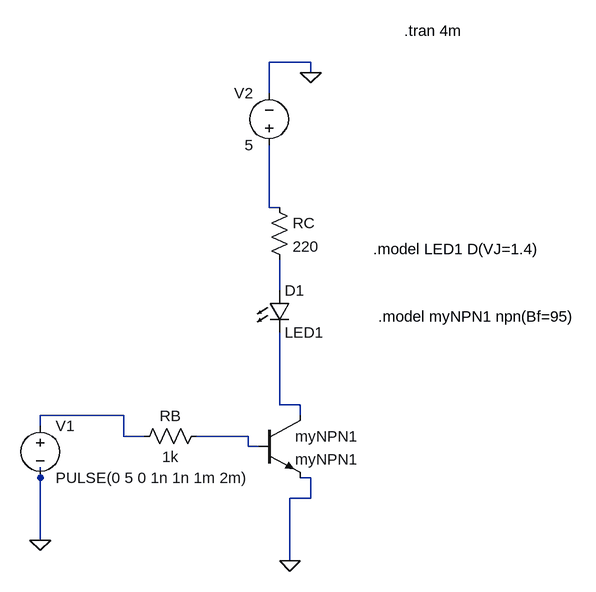
[diagram p0: schematic Draft5.asc]
Draft5.asc, the LTspice schematic file:
Version 4
SHEET 1 1180 680
WIRE 512 -416 448 -416
WIRE 512 -400 512 -416
WIRE 448 -368 448 -416
WIRE 448 -192 448 -288
WIRE 464 -192 448 -192
WIRE 464 -64 464 -112
WIRE 464 112 464 0
WIRE 496 112 464 112
WIRE 224 128 96 128
WIRE 496 128 496 112
WIRE 96 144 96 128
WIRE 224 160 224 128
WIRE 256 160 224 160
WIRE 416 160 336 160
WIRE 416 176 416 160
WIRE 432 176 416 176
WIRE 96 224 96 208
WIRE 512 224 496 224
WIRE 512 256 512 224
WIRE 512 256 480 256
WIRE 96 320 96 224
WIRE 480 352 480 256
FLAG 96 320 0
FLAG 480 352 0
FLAG 512 -400 0
SYMBOL voltage 96 128 R0
WINDOW 123 0 0 Left 0
WINDOW 39 0 0 Left 0
SYMATTR InstName V1
SYMATTR Value PULSE(0 5 0 1n 1n 1m 2m)
SYMBOL res 352 144 R90
WINDOW 0 0 56 VBottom 2
WINDOW 3 32 56 VTop 2
SYMATTR InstName RB
SYMATTR Value 1k
SYMBOL npn 432 128 R0
SYMATTR InstName myNPN1
SYMATTR Value myNPN1
SYMBOL res 448 -208 R0
SYMATTR InstName RC
SYMATTR Value 220
SYMBOL voltage 448 -272 R180
WINDOW 0 24 96 Left 2
WINDOW 3 24 16 Left 2
SYMATTR InstName V2
SYMATTR Value 5
SYMBOL LED 448 -64 R0
SYMATTR InstName D1
SYMATTR Value LED1
TEXT 656 -464 Left 2 !.tran 4m
TEXT 608 -128 Left 2 !.model LED1 D(VJ=1.4)
TEXT 616 -24 Left 2 !.model myNPN1 npn(Bf=95)

The netlist it stands for:
* Draft5.asc
V1 N004 0 PULSE(0 5 0 1n 1n 1m 2m)
RB N005 N004 1k
Q§myNPN1 N003 N005 0 0 myNPN1
RC N001 N002 220
V2 N001 0 5
D1 N002 N003 LED1
.model D D
.lib standard.dio
.model NPN NPN
.model PNP PNP
.lib standard.bjt
.tran 4m
.model LED1 D(VJ=1.4)
.model myNPN1 npn(Bf=95)
.backanno
.end